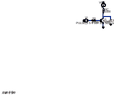
[diagram p0: schematic lab5_task1.asc]
lab5_task1.asc, the LTspice schematic file:
Version 4
SHEET 1 88044 680
WIRE 86096 -53552 86096 -53568
WIRE 86096 -53408 86096 -53472
WIRE 86224 -53408 86096 -53408
WIRE 86096 -53392 86096 -53408
WIRE 86224 -53360 86224 -53408
WIRE 85888 -53344 85840 -53344
WIRE 86032 -53344 85968 -53344
WIRE 86096 -53232 86096 -53296
FLAG 86096 -53232 0
FLAG 86224 -53280 0
FLAG 86224 -53360 VCE
FLAG 86096 -53648 0
FLAG 85760 -53344 0
SYMBOL npn 86032 -53392 R0
SYMATTR InstName Q1
SYMATTR Value 2N4401
SYMBOL voltage 85856 -53344 R90
WINDOW 0 -32 56 VBottom 2
WINDOW 3 32 56 VTop 2
WINDOW 123 0 0 Left 0
WINDOW 39 0 0 Left 0
SYMATTR InstName Vi
SYMATTR Value PULSE(0 5 0 10n 10n 500u 1m)
SYMBOL voltage 86096 -53552 R180
WINDOW 0 24 96 Left 2
WINDOW 3 24 16 Left 2
WINDOW 123 0 0 Left 0
WINDOW 39 0 0 Left 0
SYMATTR InstName VCC
SYMATTR Value 5
SYMBOL res 86080 -53568 R0
SYMATTR InstName RC
SYMATTR Value 1000
SYMBOL res 85984 -53360 R90
WINDOW 0 0 56 VBottom 2
WINDOW 3 32 56 VTop 2
SYMATTR InstName R1
SYMATTR Value 10000
TEXT 0 352 Left 2 !;tran 0 5m
TEXT -8 376 Left 2 !.tran 0 5m

The netlist it stands for:
* lab5_task1.asc
Q1 VCE N003 0 0 2N4401
Vi N002 0 PULSE(0 5 0 10n 10n 500u 1m)
VCC N001 0 5
RC N001 VCE 1000
R1 N003 N002 10000
.model NPN NPN
.model PNP PNP
.lib standard.bjt
;tran 0 5m
.tran 0 5m
.backanno
.end